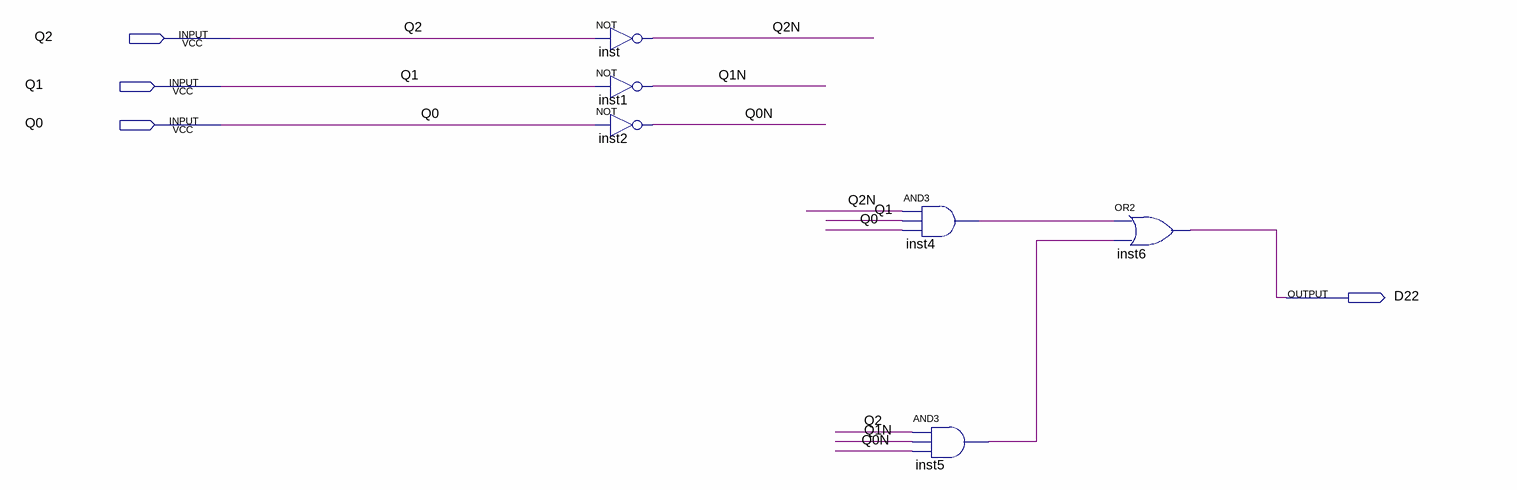
[diagram p0: schematic sheet]
// Quartus schematic D22.bdf as structural Verilog: 6 symbols, 4 pins
module D22 (
  input  Q2,
  input  Q1,
  input  Q0,
  output D22
);

  wire inst4_out, inst5_out, Q0N, Q1N, Q2N;

  not inst (Q2N, Q2);
  not inst1 (Q1N, Q1);
  not inst2 (Q0N, Q0);
  and inst4 (inst4_out, Q2N, Q1, Q0);
  and inst5 (inst5_out, Q2, Q1N, Q0N);
  or inst6 (D22, inst4_out, inst5_out);
endmodule
